# EAGLE design proto1 (EAGLE 9.6.2)
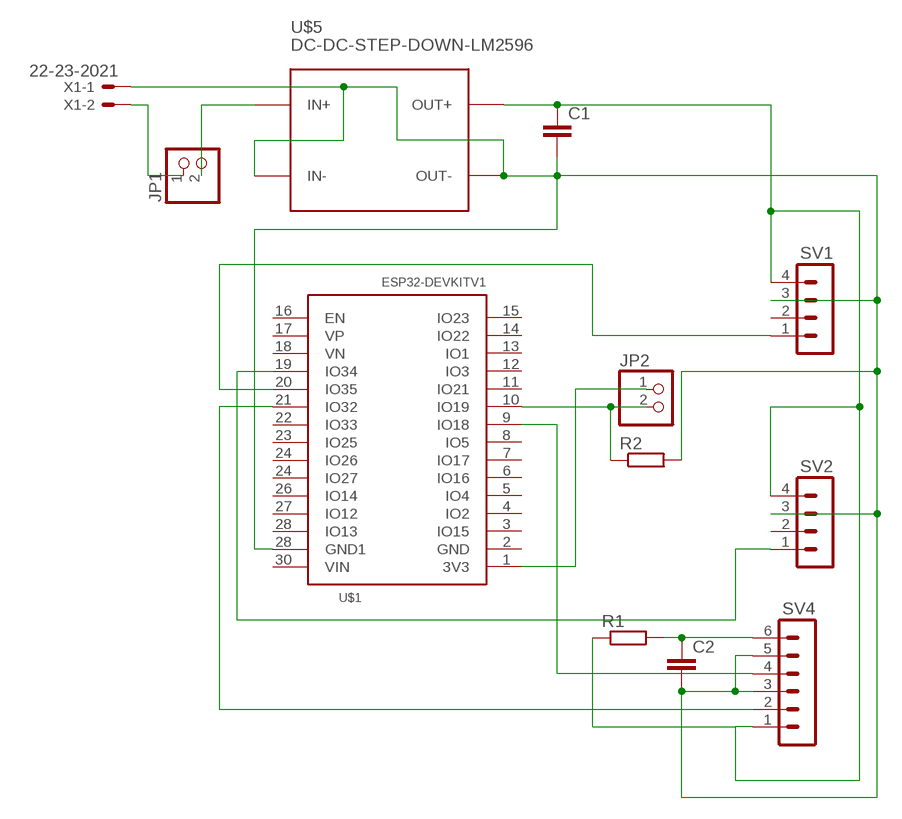
[diagram p0: schematic, sheet 1]

## Parts
C1  C2,5-3  [C2.5-3]
C2  C2,5-3  [C2.5-3]
JP1  PINHD-1X2/90  [1X02/90]
JP2  PINHD-1X2/90  [1X02/90]
R1  R-EU_0207/10  [0207/10]
R2  R-EU_0207/10  [0207/10]
SV1  MA04-1  [MA04-1]
SV2  MA04-1  [MA04-1]
SV4  MA06-1  [MA06-1]
U$1  ESP32DEVKITV1  [ESP32-DEVKITV1]
U$5  DC-DC-STEP-DOWN-LM2596  [DC-DC-STEP-DOWN-LM2596]
X1  22-23-2021  [22-23-2021]

## Nets
N$1: C1.1 R1.1 SV1.4 SV2.4 SV4.1 U$5.OUT+
N$2: C1.2 C2.2 R2.2 SV1.3 SV2.3 SV4.3 SV4.5 U$1.28(GND1) U$5.IN- U$5.OUT- X1.1
N$3: JP2.2 R2.1 U$1.10(IO19)
N$4: JP2.1 U$1.1(3V3)
N$5: SV4.4 U$1.9(IO18)
N$6: C2.1 R1.2 SV4.6
N$7: SV4.2 U$1.21(IO32)
N$8: JP1.1 X1.2
N$9: SV1.1 U$1.20(IO35)
N$10: JP1.2 U$5.IN+
N$15: SV2.1 U$1.19(IO34)
Unconnected: SV1.2 SV2.2 U$1.2(GND) U$1.3(IO15) U$1.4(IO2) U$1.5(IO4) U$1.6(IO16) U$1.7(IO17) U$1.8(IO5) U$1.11(IO21) U$1.12(IO3) U$1.13(IO1) U$1.14(IO22) U$1.15(IO23) U$1.16(EN) U$1.17(VP) U$1.18(VN) U$1.22(IO33) U$1.23(IO25) U$1.24(IO26) U$1.24(IO27) U$1.26(IO14) U$1.27(IO12) U$1.28(IO13) U$1.30(VIN)

## Library data of the parts
C1 C2 = capacitor-wima:C: CAPACITOR naming: grid - package width
JP1 JP2 = pinhead:PINHD-1X2: PIN HEADER
R1 R2 = rcl:R-EU_: RESISTOR, European symbol; SPICEPREFIX: R
SV1 SV2 = con-lstb:MA04-1: PIN HEADER; OC_FARNELL: unknown; OC_NEWARK: unknown
SV4 = con-lstb:MA06-1: PIN HEADER; OC_FARNELL: unknown; OC_NEWARK: unknown
U$1 = ESP32-DEVKITV1:ESP32DEVKITV1
U$5 = diy-modules:DC-DC-STEP-DOWN-LM2596: DC/DC Step-Down Regulator based on LM2596-ADJ chip LM2596 datasheet available here: http://www.ti.com/lit/ds/symlink/lm2596.pdf Click here to find device on ebay.com <http://www.ebay.com/sch/lm2596+power+regulator>
X1 = con-molex:22-23-2021: .100" (2.54mm) Center Header - 2 Pin; MF: MOLEX; MPN: 22-23-2021; OC_FARNELL: 1462926; OC_NEWARK: 25C3832

## Board
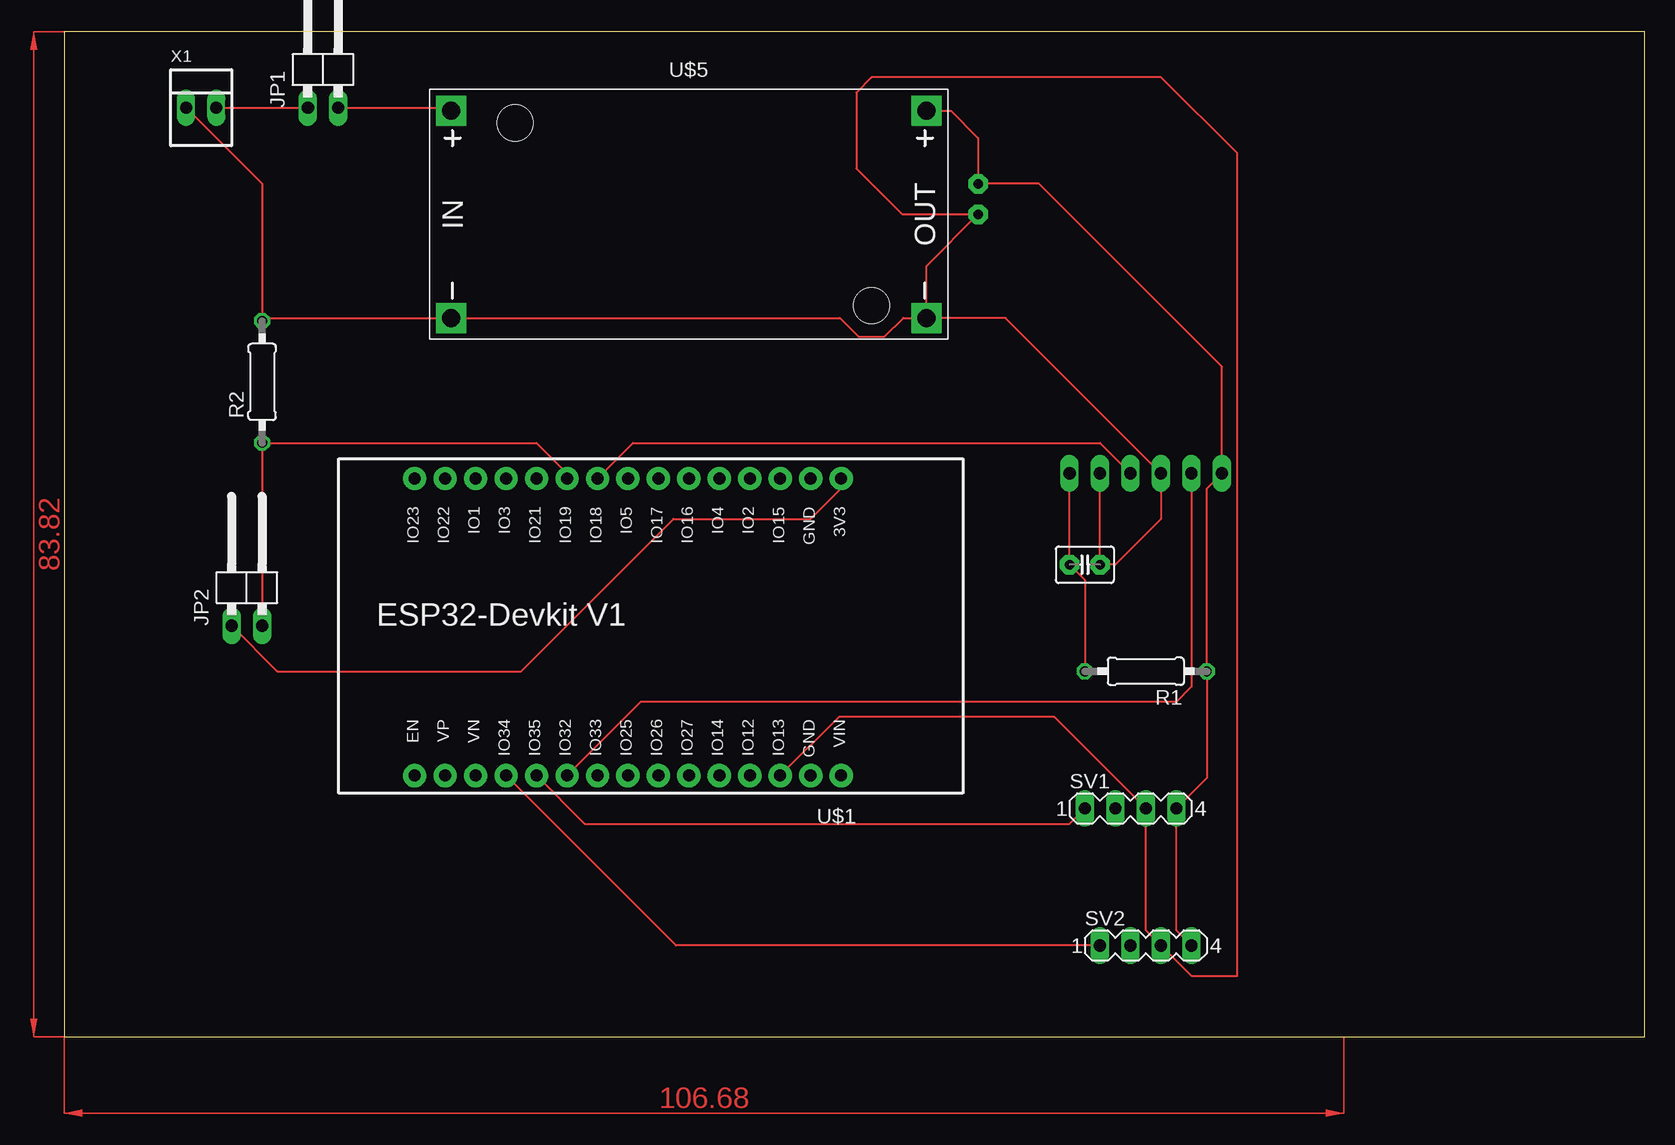
[diagram p1: board, top side]
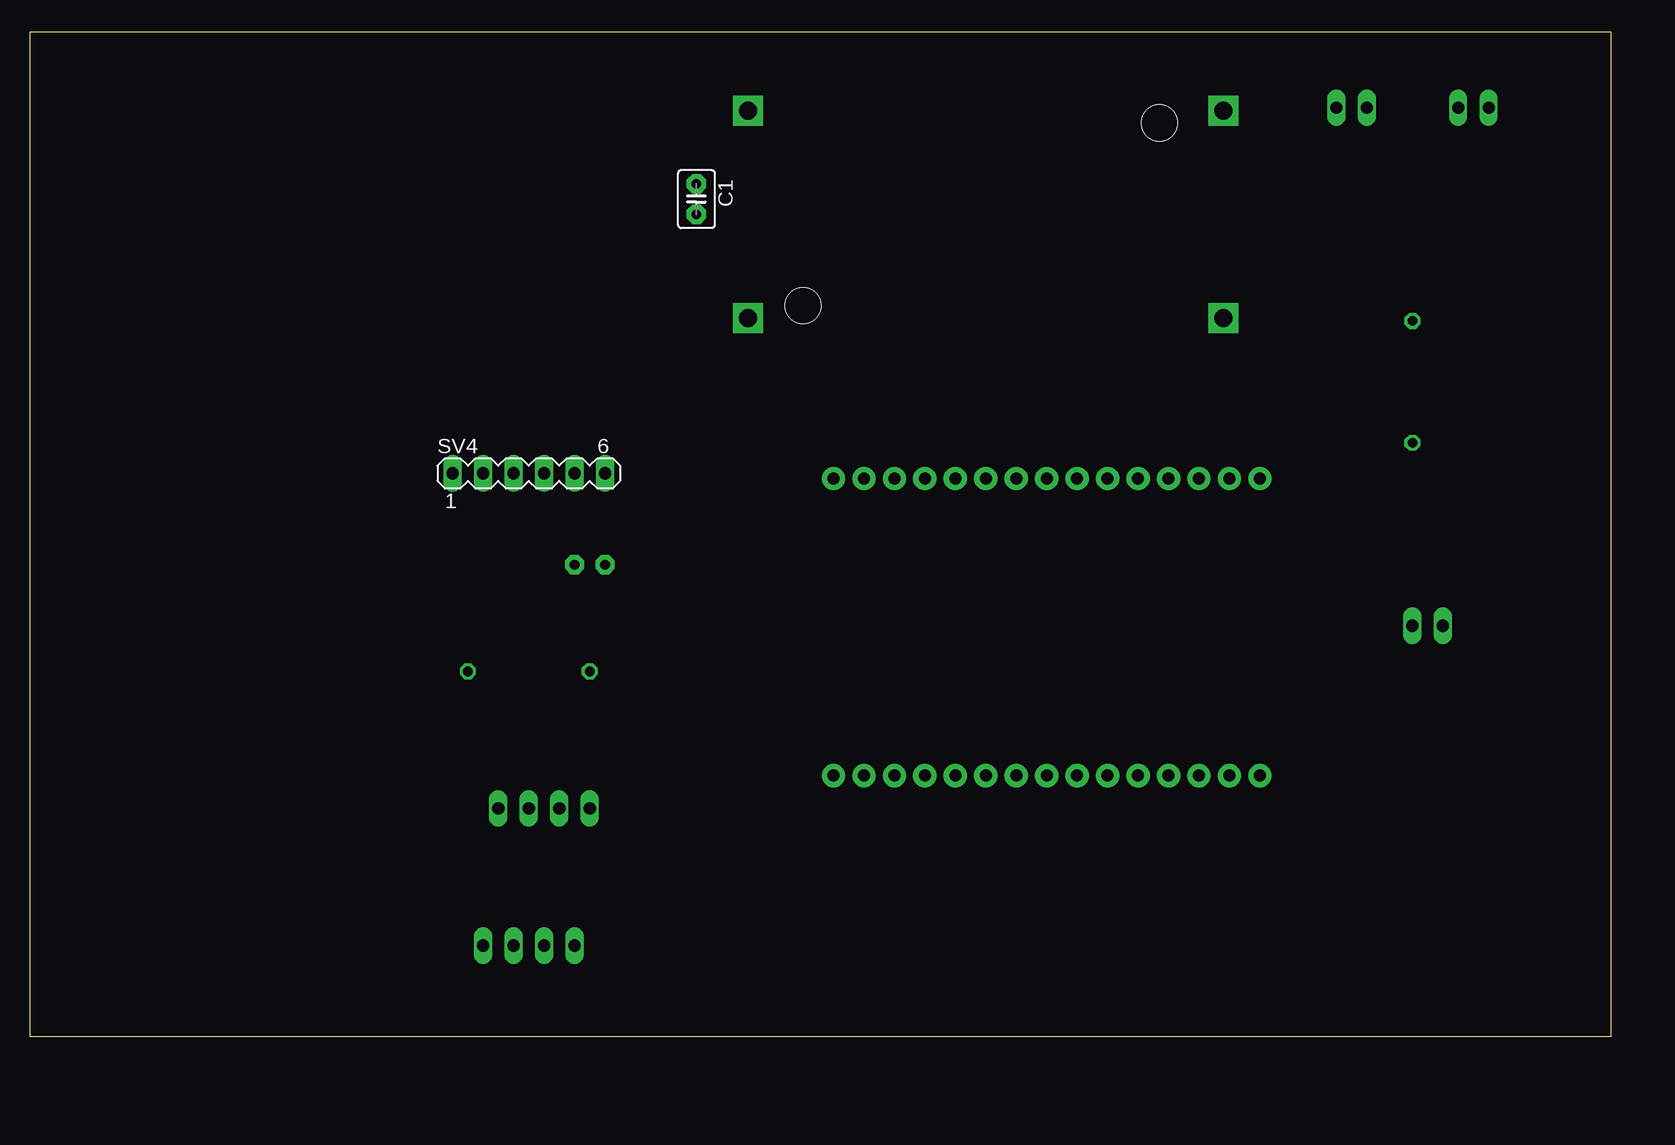
[diagram p2: board, bottom side, seen from below]

Size 131.75 x 83.81 mm. Coordinates in mm from the lower left corner, seen from the top.
Outline: 0,0 131.75,0 131.75,83.81 0,83.81 0,0
Copper layers (1*16): Top 0.035mm / dielectric 1.5mm / Bottom 0.035mm
Design rules "default": minimum track width 6mil, minimum drill 0.35mm, track to track 6mil, track to pad 6mil, pad to pad 6mil, via to via 6mil, smd to smd 6mil, copper to edge 40mil, drill to drill 6mil, minimum pad ring 10mil, minimum via ring 8mil, stop-mask expansion 4mil, vias tented up to drill 0mil, thermal gap 10mil

### Footprints (pad centres in the part's own frame; a part is rotated, then mirrored left to right if it is on the bottom)
C2.5-3 = drill 0.813 pad 1.6 octagon: 1 -1.27,0; 2 1.27,0
1X02/90 = drill 1.016 long: 1 -1.27,-3.81; 2 1.27,-3.81
0207/10 = drill 0.813 octagon: 1 -5.08,0; 2 5.08,0
MA04-1 = drill 1.016 long: 1 -3.81,0; 2 -1.27,0; 3 1.27,0; 4 3.81,0
MA06-1 = drill 1.016 long: 1 -6.35,0; 2 -3.81,0; 3 -1.27,0; 4 1.27,0; 5 3.81,0; 6 6.35,0
ESP32-DEVKITV1 = drill 1 pad 1.93: 1 -22.87,-13.54; 2 -20.33,-13.54; 3 -17.79,-13.54; 4 -15.25,-13.54; 5 -12.71,-13.54; 6 -10.17,-13.54; 7 -7.63,-13.54; 8 -5.09,-13.54; 9 -2.55,-13.54; 10 -0.01,-13.54; 11 2.53,-13.54; 12 5.07,-13.54; 13 7.61,-13.54; 14 10.15,-13.54; 15 12.69,-13.54; 16 12.69,11.23; 17 10.15,11.23; 18 7.61,11.23; 19 5.07,11.23; 20 2.53,11.23; 21 -0.01,11.23; 22 -2.55,11.23; 23 -5.09,11.23; 24 -7.63,11.23; 25 -10.17,11.23; 26 -12.71,11.23; 27 -15.25,11.23; 28 -17.79,11.23; 29 -20.33,11.23; 30 -22.87,11.23
DC-DC-STEP-DOWN-LM2596 = drill 1.5 pad 2.5 square: IN+ -19.812,8.636; IN- -19.812,-8.636; OUT+ 19.812,8.636; OUT- 19.812,-8.636 | hole 3: -14.478,7.62; 15.24,-7.62
22-23-2021 = drill 1 long: 1 -1.27,0; 2 1.27,0

### Placement (x,y rotation side)
C1  76.2,69.85 270 bottom
C2  85.09,39.37 0 top
JP1  21.59,81.28 0 top
JP2  15.24,38.1 0 top
R1  90.17,30.48 180 top
R2  16.51,54.61 90 top
SV1  88.9,19.05 0 top
SV2  90.17,7.62 0 top
SV4  90.17,46.99 0 bottom
U$1  41.91,33.02 180 top
U$5  52.07,68.58 0 top
X1  11.43,77.47 0 top

### Tracks (layer width: path | path; a pad name or v marks a point on that pad's centre or on a via)
N$1
  Top 0.152: U$5.OUT+ 73.91,77.22 76.2,74.93 C1.1 81.28,71.12 96.52,55.88 SV4.1 95.25,45.72 R1.1 95.25,21.59 SV1.4 92.71,8.89 SV2.4
N$2
  Top 0.152: X1.1 16.51,71.12 R2.2 16.76,59.94 U$5.IN- 64.66,59.94 66.24,58.37 68.38,58.37 69.96,59.94 U$5.OUT- | 59.89,21.79 U$1.28 64.58,26.67 82.55,26.67 SV1.3 90.17,8.89 SV2.3 93.98,5.08 97.79,5.08 97.79,73.66 91.44,80.01 67.31,80.01 66.04,78.74 66.04,72.39 69.85,68.58 C1.2 71.88,64.26 U$5.OUT- | SV4.5 C2.2 87.63,39.37 91.44,43.18 SV4.3 78.49,59.94 U$5.OUT-
N$3
  Top 0.152: JP2.2 R2.1 39.37,49.53 41.92,46.98 U$1.10
N$4
  Top 0.152: JP2.1 17.78,30.48 38.1,30.48 50.8,43.18 62.23,43.18 64.78,45.73 U$1.1
N$5
  Top 0.152: U$1.9 47.43,49.53 86.36,49.53 SV4.4
N$6
  Top 0.152: R1.2 85.09,38.1 C2.1 SV4.6
N$7
  Top 0.152: SV4.2 93.98,29.21 92.71,27.94 48.07,27.94 U$1.21
N$8
  Top 0.152: X1.2 JP1.1
N$9
  Top 0.152: U$1.20 43.39,17.78 83.82,17.78 SV1.1
N$10
  Top 0.152: JP1.2 32,77.47 U$5.IN+
  Bottom 0.406: 32,77.47 U$5.IN+
N$15
  Top 0.152: SV2.1 51.01,7.62 U$1.19
(copper drawn outside any net)
  shapes: Top area x2